# Altium schematic sheet SW3518.SchDoc
size A4; SheetNumber: 3; SheetTotal: 3
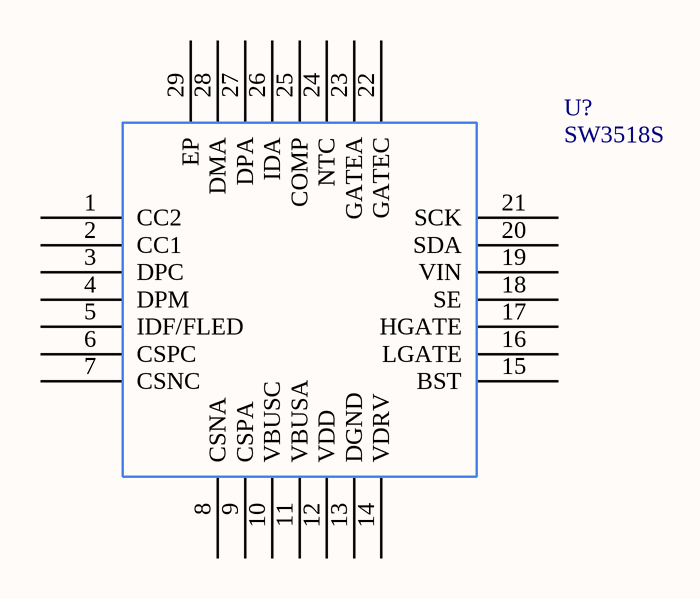
[diagram p0: SW3518.SchDoc]

## Parts
U?  SW3518S

## Nets

Not connected (* = marked no-connect by the designer): U? 1(CC2) 2(CC1) 3(DPC) 4(DPM) 5(IDF/FLED) 6(CSPC) 7(CSNC) 8(CSNA) 9(CSPA) 10(VBUSC) 11(VBUSA) 12(VDD) 13(DGND) 14(VDRV) 15(BST) 16(LGATE) 17(HGATE) 18(SE) 19(VIN) 20(SDA) 21(SCK) 22(GATEC) 23(GATEA) 24(NTC) 25(COMP) 26(IDA) 27(DPA) 28(DMA) 29(EP)

## Library data of the parts
U? = SW3518S: SW3518S PD快充控制器 降压型